# Altium schematic sheet Sheet1.SchDoc
size A4
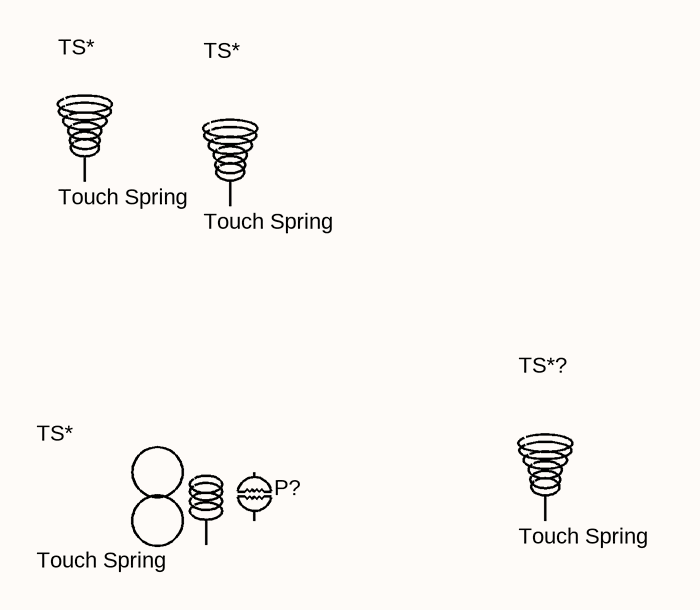
[diagram p0: Sheet1.SchDoc]

## Parts
(Parts that share a designator on the sheet are numbered #1, #2 ... from top to bottom, then left to right.)
P?  spark arrestor  [J2]  (value not drawn)  (no BOM)
TS*#1  Touch Spring
TS*#2  Touch Spring
TS*#3  Touch Spring
TS*?  Touch Spring

## Nets

Not connected (* = marked no-connect by the designer): P? 1 2; TS*#1 1; TS*#2 1; TS*#3 1; TS*? 1

## Library data of the parts
P? = spark arrestor: Header, 2-Pin; LatestRevisionDate: 17-Jul-2002; LatestRevisionNote: Re-released for DXP Platform.; Publisher: Altium Limited